# Altium schematic sheet Sheet_CURRENT_MEAS.SchDoc
size A4; SheetNumber: 5; SheetTotal: 5
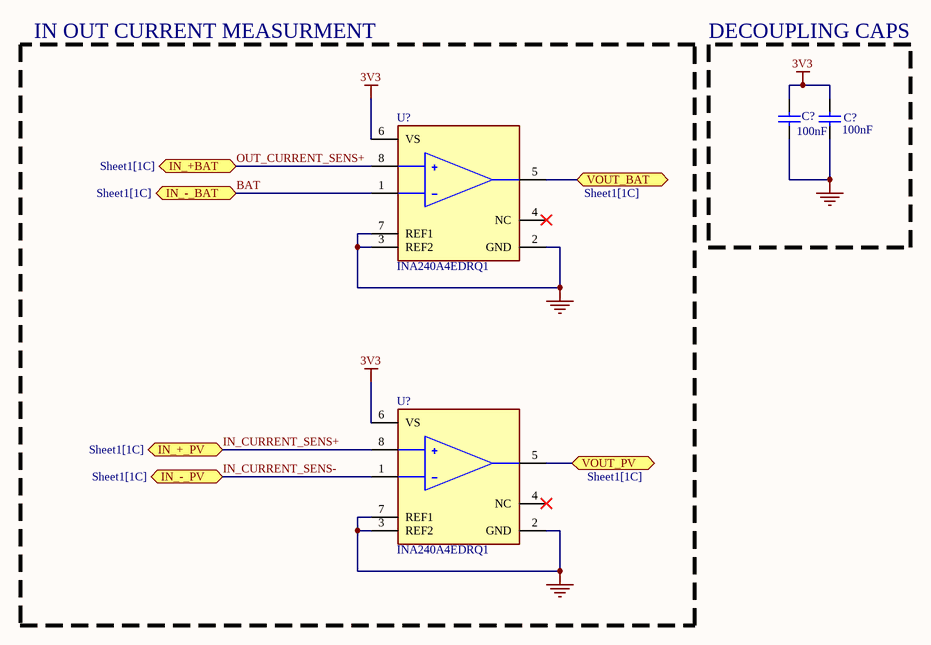
[diagram p0: Sheet_CURRENT_MEAS.SchDoc]

## Parts
(Parts that share a designator on the sheet are numbered #1, #2 ... from top to bottom, then left to right.)
C?#1  100nF  [CAPC2013X140X45LL15T25]
C?#2  100nF  [CAPC2013X140X45LL15T25]
U?#1  INA240A4EDRQ1  [FP-D0008A-IPC_C]
U?#2  INA240A4EDRQ1  [FP-D0008A-IPC_C]

## Blocks framed on the sheet
IN OUT CURRENT MEASURMENT: U?#1 U?#2
DECOUPLING CAPS: C?#1 C?#2

## Ports
IN_+_PV (bidir, see Sheet1[1C]), IN_+BAT (bidir, see Sheet1[1C]), IN_-_BAT (bidir, see Sheet1[1C]), IN_-_PV (bidir, see Sheet1[1C]), VOUT_BAT (bidir, see Sheet1[1C]), VOUT_PV (bidir, see Sheet1[1C])

## Nets
3V3: C?#1.2 C?#2.2 U?#1.6(VS) U?#2.6(VS)
GND: C?#1.1 C?#2.1 U?#1.2(GND) U?#1.3(REF2) U?#1.7(REF1) U?#2.2(GND) U?#2.3(REF2) U?#2.7(REF1)
BAT: U?#1.1(IN-) ; port IN_-_BAT
IN_CURRENT_SENS+: U?#2.8(IN+) ; port IN_+_PV
IN_CURRENT_SENS-: U?#2.1(IN-) ; port IN_-_PV
OUT_CURRENT_SENS+: U?#1.8(IN+) ; port IN_+BAT
VOUT_BAT: U?#1.5(OUT) ; port VOUT_BAT
VOUT_PV: U?#2.5(OUT) ; port VOUT_PV

Not connected (* = marked no-connect by the designer): U?#1 4(NC)*; U?#2 4(NC)*

## Library data of the parts
C?#1 C?#2 = CMP-2007-03344-1: Part Number: GCM21BR71E104KA37L; Manufacturer: Murata
U?#1 U?#2 = CMP-04895-000250-1: IC CURR SENSE 1 CIRCUIT 8SOIC; RoHS Compliant: Yes; Max Operating Temperature: 150°C; Min Operating Temperature: -40°C